# Altium project PCB_RELAIS.PrjPcb
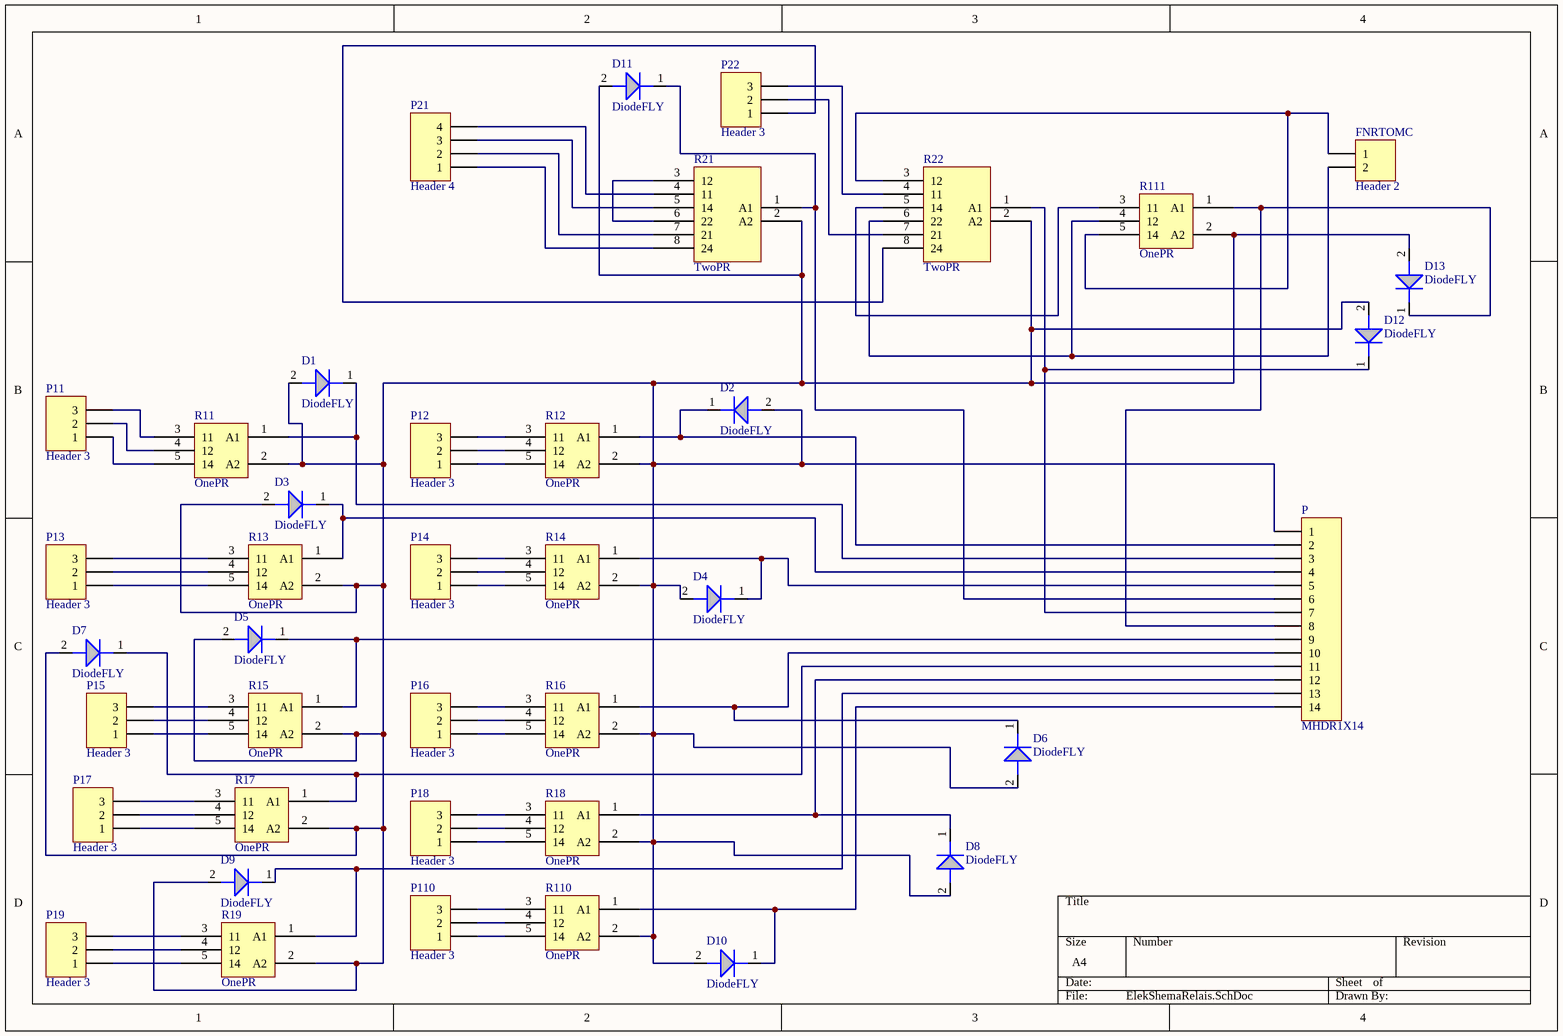
[diagram p0: ElekShemaRelais.SchDoc]
1 sheet, 40 parts. Net scope: global (net labels, ports and power ports of the same name join across sheets).
Board file: PCBRelais.PcbDoc

## Sheet ElekShemaRelais.SchDoc
size A4

### Parts
D1  DiodeFLY  [DiodeFLY]
D2  DiodeFLY  [DiodeFLY]
D3  DiodeFLY  [DiodeFLY]
D4  DiodeFLY  [DiodeFLY]
D5  DiodeFLY  [DiodeFLY]
D6  DiodeFLY  [DiodeFLY]
D7  DiodeFLY  [DiodeFLY]
D8  DiodeFLY  [DiodeFLY]
D9  DiodeFLY  [DiodeFLY]
D10  DiodeFLY  [DiodeFLY]
D11  DiodeFLY  [DiodeFLY]
D12  DiodeFLY  [DiodeFLY]
D13  DiodeFLY  [DiodeFLY]
FNRTOMC  Header 2  [HDR2]
P  MHDR1X14  [HDR14]
P11  Header 3  [HDR3]
P12  Header 3  [HDR3]
P13  Header 3  [HDR3]
P14  Header 3  [HDR3]
P15  Header 3  [HDR3]
P16  Header 3  [HDR3]
P17  Header 3  [HDR3]
P18  Header 3  [HDR3]
P19  Header 3  [HDR3]
P21  Header 4  [HDR4]
P22  Header 3  [HDR3]
P110  Header 3  [HDR3]
R11  OnePR  [EENPOOL]
R12  OnePR  [EENPOOL]
R13  OnePR  [EENPOOL]
R14  OnePR  [EENPOOL]
R15  OnePR  [EENPOOL]
R16  OnePR  [EENPOOL]
R17  OnePR  [EENPOOL]
R18  OnePR  [EENPOOL]
R19  OnePR  [EENPOOL]
R21  TwoPR  [TWEEPOOL]
R22  TwoPR  [TWEEPOOL]
R110  OnePR  [EENPOOL]
R111  OnePR  [EENPOOL]

### Nets
NetD1_1: D1.1 P.3 R11.1(A1)
NetD1_2: D1.2 D2.2 D3.2 D4.2 D5.2 D6.2 D7.2 D8.2 D9.2 D10.2 D11.2 D12.2 D13.2 P.1 R11.2(A2) R12.2(A2) R13.2(A2) R14.2(A2) R15.2(A2) R16.2(A2) R17.2(A2) R18.2(A2) R19.2(A2) R21.2(A2) R22.2(A2) R110.2(A2) R111.2(A2)
NetD2_1: D2.1 P.2 R12.1(A1)
NetD3_1: D3.1 P.4 R13.1(A1)
NetD4_1: D4.1 P.5 R14.1(A1)
NetD5_1: D5.1 P.9 R15.1(A1)
NetD6_1: D6.1 P.10 R16.1(A1)
NetD7_1: D7.1 P.11 R17.1(A1)
NetD8_1: D8.1 P.12 R18.1(A1)
NetD9_1: D9.1 P.13 R19.1(A1)
NetD10_1: D10.1 P.14 R110.1(A1)
NetD11_1: D11.1 P.6 R21.1(A1)
NetD12_1: D12.1 P.7 R22.1(A1)
NetD13_1: D13.1 P.8 R111.1(A1)
NetFNRTOMC_1: FNRTOMC.1 R22.3(12) R111.5(14)
NetFNRTOMC_2: FNRTOMC.2 R22.6(22) R111.4(12)
NetP11_1: P11.1 R11.5(14)
NetP11_2: P11.2 R11.4(12)
NetP11_3: P11.3 R11.3(11)
NetP12_1: P12.1 R12.5(14)
NetP12_2: P12.2 R12.4(12)
NetP12_3: P12.3 R12.3(11)
NetP13_1: P13.1 R13.5(14)
NetP13_2: P13.2 R13.4(12)
NetP13_3: P13.3 R13.3(11)
NetP14_1: P14.1 R14.5(14)
NetP14_2: P14.2 R14.4(12)
NetP14_3: P14.3 R14.3(11)
NetP15_1: P15.1 R15.5(14)
NetP15_2: P15.2 R15.4(12)
NetP15_3: P15.3 R15.3(11)
NetP16_1: P16.1 R16.5(14)
NetP16_2: P16.2 R16.4(12)
NetP16_3: P16.3 R16.3(11)
NetP17_1: P17.1 R17.5(14)
NetP17_2: P17.2 R17.4(12)
NetP17_3: P17.3 R17.3(11)
NetP18_1: P18.1 R18.5(14)
NetP18_2: P18.2 R18.4(12)
NetP18_3: P18.3 R18.3(11)
NetP19_1: P19.1 R19.5(14)
NetP19_2: P19.2 R19.4(12)
NetP19_3: P19.3 R19.3(11)
NetP21_1: P21.1 R21.8(24)
NetP21_2: P21.2 R21.7(21)
NetP21_3: P21.3 R21.5(14)
NetP21_4: P21.4 R21.4(11)
NetP22_1: P22.1 R22.8(24)
NetP22_2: P22.2 R22.7(21)
NetP22_3: P22.3 R22.4(11)
NetP110_1: P110.1 R110.5(14)
NetP110_2: P110.2 R110.4(12)
NetP110_3: P110.3 R110.3(11)
NetR21_3: R21.3(12) R21.6(22)
NetR22_5: R22.5(14) R111.3(11)

### Library data of the parts
FNRTOMC = Header 2: Header, 2-Pin; LatestRevisionDate: 17-Jul-2002; LatestRevisionNote: Re-released for DXP Platform.; Publisher: Altium Limited
P = MHDR1X14: Header, 14-Pin; LatestRevisionDate: 17-Jul-2002; LatestRevisionNote: Re-released for DXP Platform.; Publisher: Altium Limited
P11-P19 P22 P110 = Header 3: Header, 3-Pin; LatestRevisionDate: 17-Jul-2002; LatestRevisionNote: Re-released for DXP Platform.; Publisher: Altium Limited
P21 = Header 4: Header, 4-Pin; LatestRevisionDate: 17-Jul-2002; LatestRevisionNote: Re-released for DXP Platform.; Publisher: Altium Limited
R11-R19 R110 R111 = R1
R21 R22 = R2